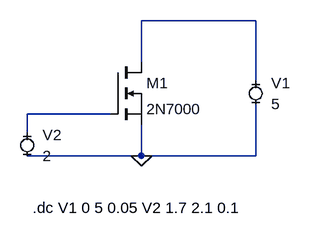
[diagram p0: schematic Ic(Uvs).asc]
Ic(Uvs).asc, the LTspice schematic file:
Version 4
SHEET 1 880 680
WIRE 368 96 192 96
WIRE 192 160 192 96
WIRE 368 192 368 96
WIRE 144 240 16 240
WIRE 16 272 16 240
WIRE 192 304 192 256
WIRE 192 304 16 304
WIRE 368 304 368 224
WIRE 368 304 192 304
FLAG 192 304 0
SYMBOL nmos 144 160 R0
SYMATTR InstName M1
SYMATTR Value 2N7000
SYMBOL MiniSyms4\\voltage- 368 208 R0
WINDOW 123 0 0 Left 2
WINDOW 39 0 0 Left 2
SYMATTR InstName V1
SYMATTR Value 5
SYMBOL MiniSyms4\\voltage- 16 288 R0
WINDOW 123 0 0 Left 2
WINDOW 39 0 0 Left 2
SYMATTR InstName V2
SYMATTR Value 2
TEXT 24 384 Left 2 !.dc V1 0 5 0.05 V2 1.7 2.1 0.1

The netlist it stands for:
* Ic(Uvs).asc
M1 N001 N002 0 0 2N7000
V1 N001 0 5
V2 N002 0 2
.model NMOS NMOS
.model PMOS PMOS
.lib standard.mos
.dc V1 0 5 0.05 V2 1.7 2.1 0.1
.backanno
.end